# Altium project Big-MCU_REVB.PrjPcb
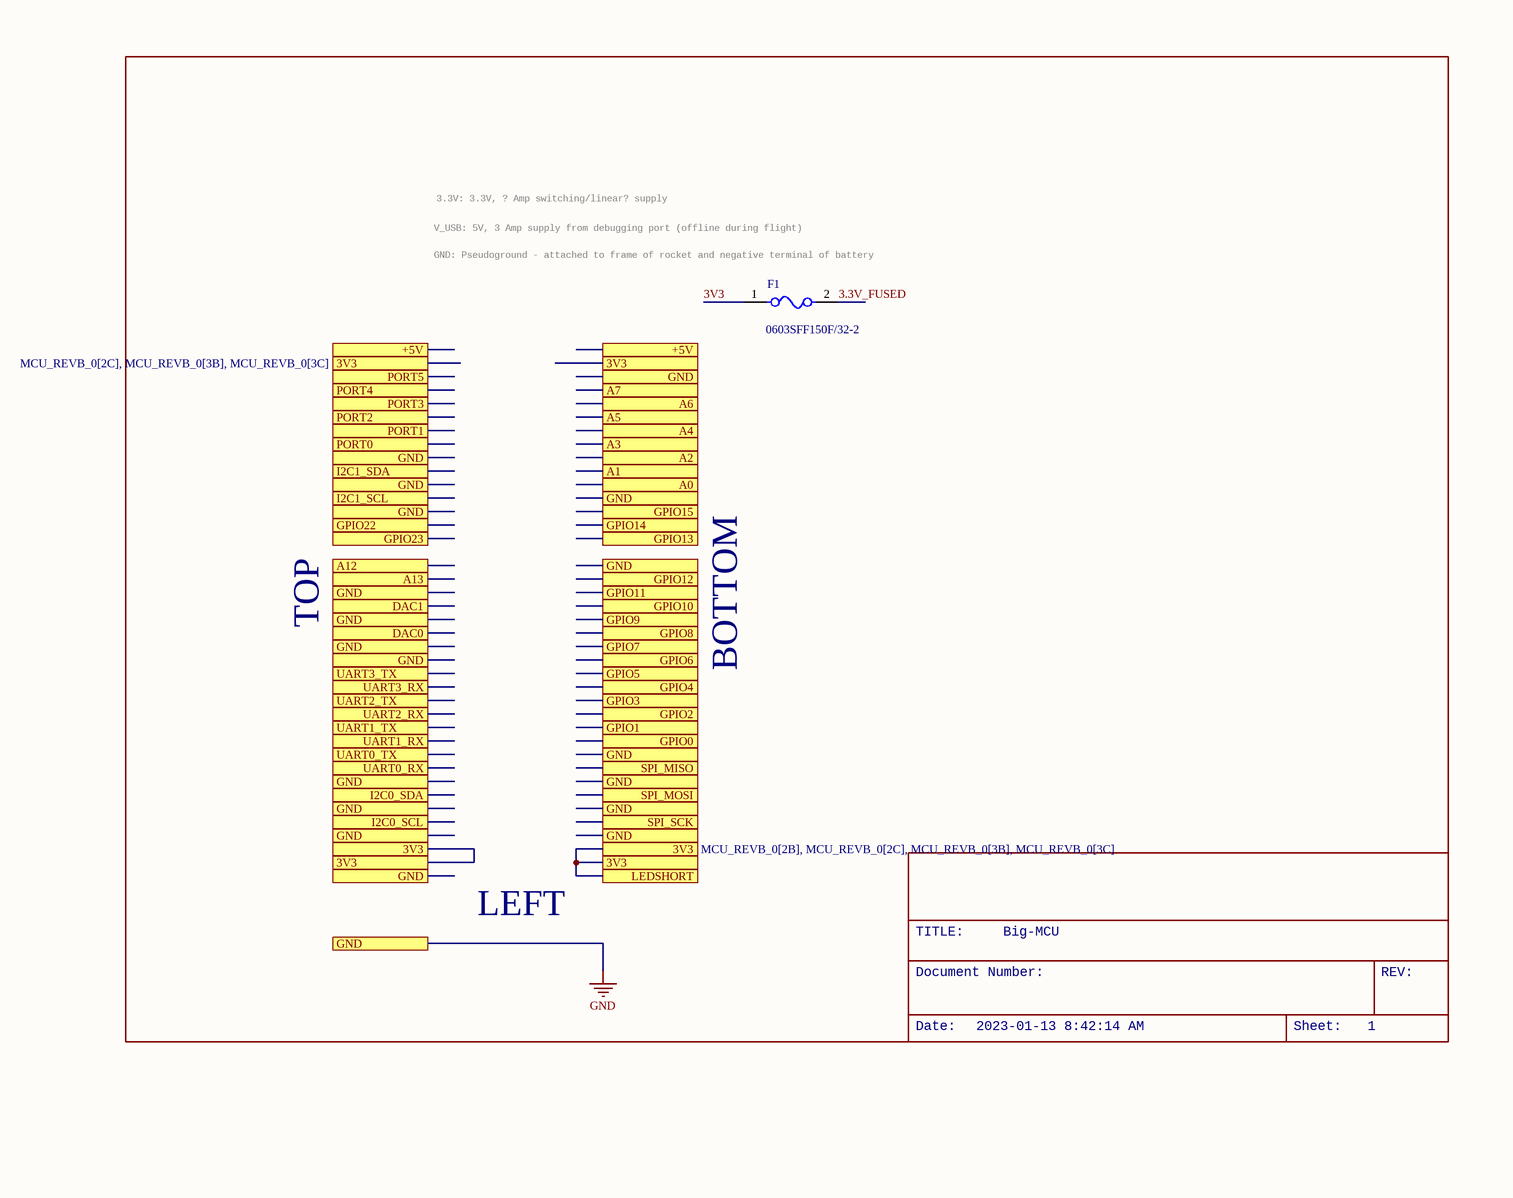
[diagram p0: MCU_REVB_0.SchDoc]
5 sheets, 113 parts. Net scope: global (net labels, ports and power ports of the same name join across sheets).
Board file: MCU_REVB.PcbDoc
Sheets:
  MCU_REVB_0.SchDoc
  MCU_REVB_1.SchDoc
  MCU_REVB_2.SchDoc
  MCU_REVB_3.SchDoc
  MCU_REVB_4.SchDoc

## Sheet MCU_REVB_0.SchDoc: Big-MCU
size 270 x 223 mm; Origin: Eagle; Date: 2023-01-13 8:42:14 AM; SheetNumber: 1; GateName_1: G$1; SymbolName_1: LETTER_L; LibraryName: frames; DeviceSetName: LETTER_L; GateName_2: G$2; SymbolName_2: DOCFIELD; Sheet: Sheet:; REV: REV:

### Parts
F1  0603SFF150F/32-2  [RESC1608X10N]

### Ports
3V3 (see MCU_REVB_0[2B], MCU_REVB_0[2C], MCU_REVB_0[3B], MCU_REVB_0[3C]), 3V3 (see MCU_REVB_0[2B], MCU_REVB_0[2C], MCU_REVB_0[3C]), 3V3 (see MCU_REVB_0[2C], MCU_REVB_0[3B], MCU_REVB_0[3C]), +5V (see MCU_REVB_0[2B]), +5V (see MCU_REVB_0[3B]), A0, A1, A2, A3, A4, A5, A6, A7, A12, A13, DAC0, DAC1, GND (see MCU_REVB_0[2B], MCU_REVB_0[2C], MCU_REVB_0[2D], MCU_REVB_0[3B], MCU_REVB_0[3C]), GND (see MCU_REVB_0[2B], MCU_REVB_0[2C], MCU_REVB_0[3B], MCU_REVB_0[3C]), GPIO0, GPIO1, GPIO2, GPIO3, GPIO4, GPIO5, GPIO6, GPIO7, GPIO8, GPIO9, GPIO10, GPIO11, GPIO12, GPIO13, GPIO14, GPIO15, GPIO22, GPIO23, I2C0_SCL, I2C0_SDA, I2C1_SCL, I2C1_SDA, LEDSHORT, PORT0, PORT1, PORT2, PORT3, PORT4, PORT5, SPI_MISO, SPI_MOSI, SPI_SCK, UART0_RX, UART0_TX, UART1_RX, UART1_TX, UART2_RX, UART2_TX, UART3_RX, UART3_TX

### Nets
3.3V_FUSED: F1.2
3V3: F1.1
3V3: port 3V3, port LEDSHORT  [a separate net that carries the same name]

### Notes on the sheet
- 3.3V: 3.3V, ? Amp switching/linear? supply
- V_USB: 5V, 3 Amp supply from debugging port (offline during flight)
- (near F1) GND: Pseudoground - attached to frame of rocket and negative terminal of battery
- TOP
- BOTTOM
- LEFT
- TITLE:
- Big-MCU
- Document Number:
- REV:
- Date:
- 2023-01-13 8:42:14 AM
- Sheet:
- 1

### Library data of the parts
F1 = CMP-00019-1: 0603SFF Series - 0603 Size Lead-Free, Halogen Free, Fast-Acting Chip Fuse, 1.5 A, 63 VDC, RoHS; Approvals: UL; Fuse Type: Board Mount (Cartridge Style Excluded); DC Cold Resistance: 175mR; Current Rating: 500mA; Value: 175mR; Voltage Rating: 50V; Case/Package: 0603; Pins: 2; Mounting Technology: Surface Mount; Case Code (Metric): 1608; Fuse Current: 500mA; Reach SVHC Compliant: Yes; Series: SF-0603S; Width: 0.8mm; Max Operating Temperature: 105°C; Packaging: Tape and Reel; Depth: 0.8mm; Min Operating Temperature: -20°C; RoHS Compliant: Yes; Package Quantity: 10000; Height: 0.45mm; Length: 1.6mm; Current: 500mA; Case Code (Imperial): 0603; Contact Plating: Tin; Voltage Rating (DC): 50V; Termination: SMD/SMT

## Sheet MCU_REVB_1.SchDoc: Big-MCU
size 270 x 228 mm; Origin: Eagle; Date: 2023-01-13 8:42:14 AM; SheetNumber: 2; GateName_1: G$1; SymbolName_1: LETTER_L; LibraryName: frames; DeviceSetName: LETTER_L; GateName_2: G$2; SymbolName_2: DOCFIELD; Sheet: Sheet:; REV: REV:
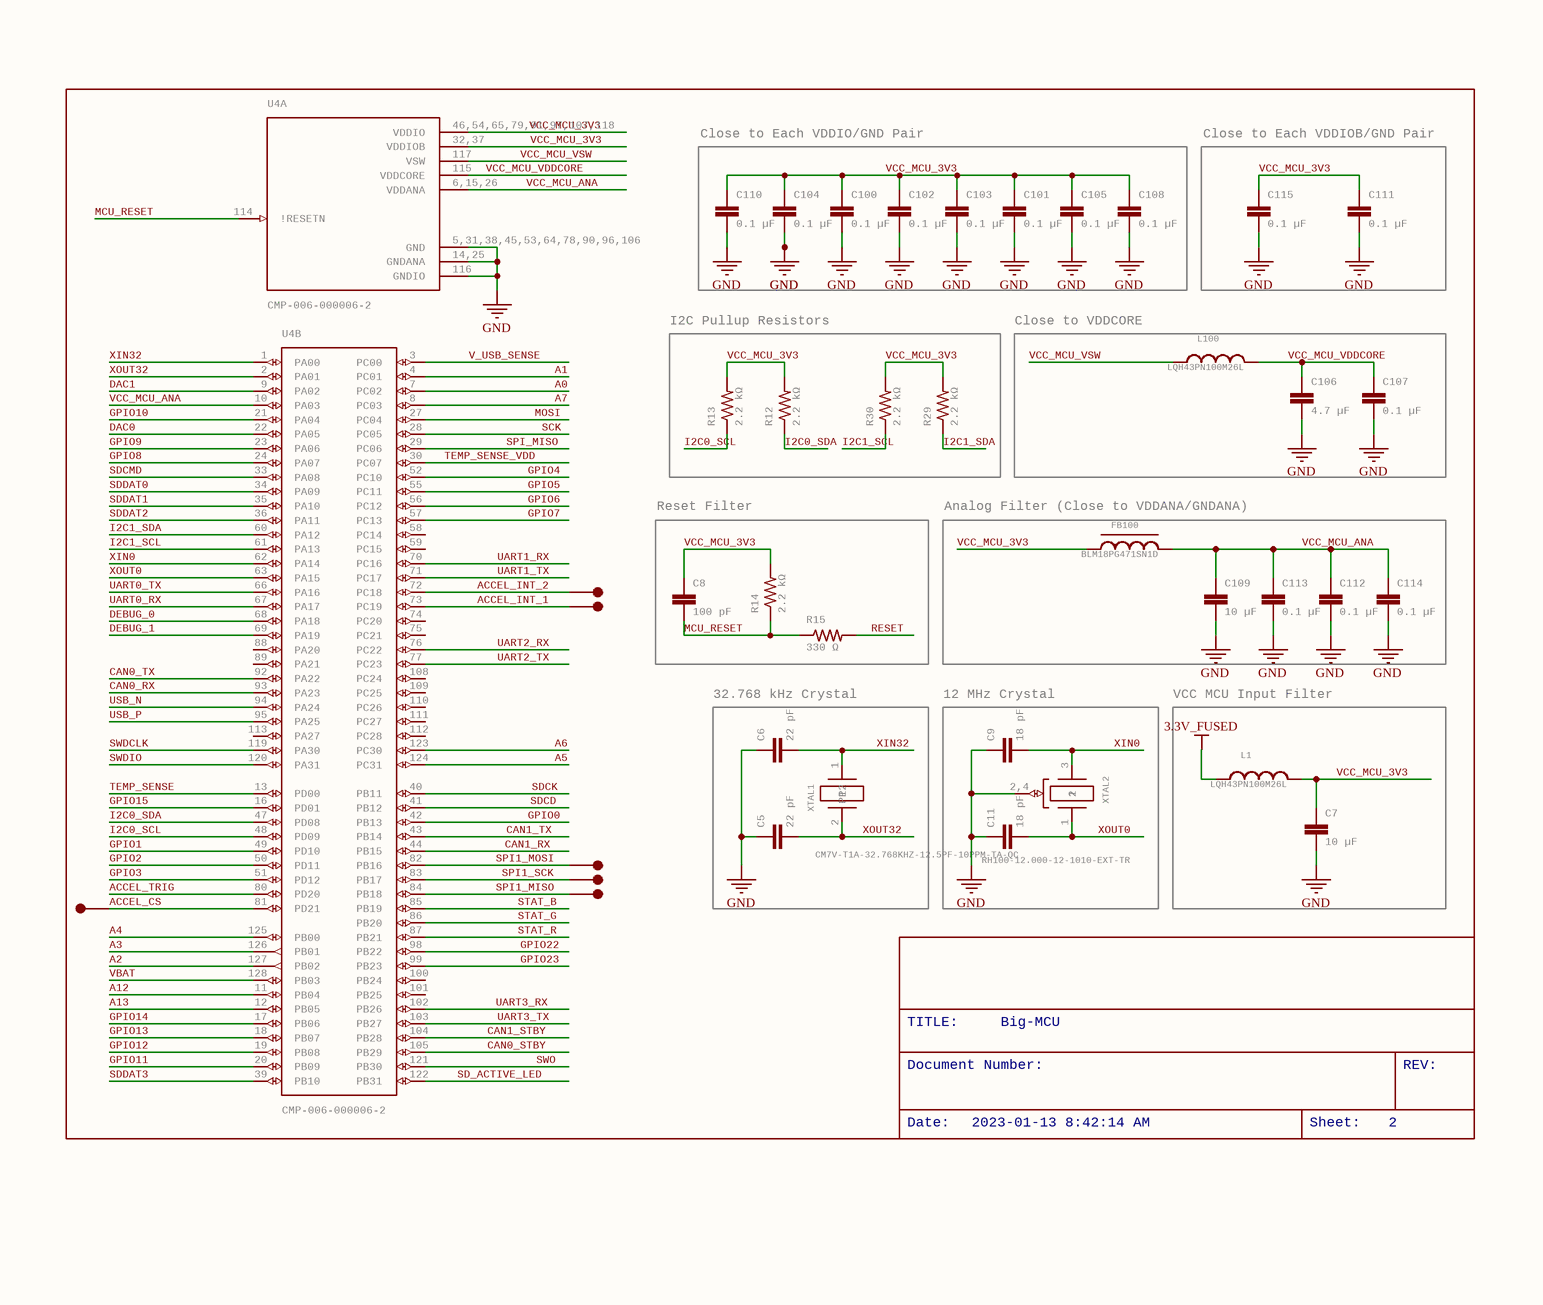
[diagram p1: MCU_REVB_1.SchDoc]

### Parts
C5  22 pF  [C0805]
C6  22 pF  [C0805]
C7  10 µF  [C1206]
C8  100 pF  [C0805]
C9  18 pF  [C0805]
C11  18 pF  [C0805]
C100  0.1 µF  [C0805]
C101  0.1 µF  [C0805]
C102  0.1 µF  [C0805]
C103  0.1 µF  [C0805]
C104  0.1 µF  [C0805]
C105  0.1 µF  [C0805]
C106  4.7 µF  [C0805]
C107  0.1 µF  [C0805]
C108  0.1 µF  [C0805]
C109  10 µF  [C1206]
C110  0.1 µF  [C0805]
C111  0.1 µF  [C0805]
C112  0.1 µF  [C0805]
C113  0.1 µF  [C0805]
C114  0.1 µF  [C0805]
C115  0.1 µF  [C0805]
FB100  BLM18PG471SN1D  [FP-BLM18-0_15-t0_8-MFG]
L1  LQH43PN100M26L  [LQH43PN100M26L]
L100  LQH43PN100M26L  [LQH43PN100M26L]
R12  2.2 kΩ  [6-0805_N]
R13  2.2 kΩ  [6-0805_N]
R14  2.2 kΩ  [6-0805_N]
R15  330 Ω  [6-0805_N]
R29  2.2 kΩ  [6-0805_N]
R30  2.2 kΩ  [6-0805_N]
TP11  5015  [KEYSTONE_5015]  (value not drawn)
TP12  5015  [KEYSTONE_5015]  (value not drawn)
TP13  5015  [KEYSTONE_5015]  (value not drawn)
TP14  5015  [KEYSTONE_5015]  (value not drawn)
TP15  5015  [KEYSTONE_5015]  (value not drawn)
TP16  5015  [KEYSTONE_5015]  (value not drawn)
U4  CMP-006-000006-2  [FP-MG-IPC_A]  (parts A,B of 2)
XTAL1  CM7V-T1A-32.768KHZ-12.5PF-10PPM-TA-QC  [DFN245P320X65-2N]
XTAL2  RH100-12.000-12-1010-EXT-TR  [SON160P320X80-4N]

### Blocks framed on the sheet
Close to Each VDDIO/GND Pair: C100-C105 C108 C110
Close to Each VDDIOB/GND Pair: C111 C115
I2C Pullup Resistors: R12 R13 R29 R30
Close to VDDCORE: C106 C107 L100
Reset Filter: C8 R14 R15
Analog Filter (Close to VDDANA/GNDANA): C109 C112-C114 FB100
32.768 kHz Crystal: C5 C6 XTAL1
12 MHz Crystal: C9 C11 XTAL2
VCC MCU Input Filter: C7 L1

### Nets
3.3V_FUSED: L1.1
GND: C5.1 C6.1 C7.2 C9.1 C11.1 C100.2 C101.2 C102.2 C103.2 C104.2 C105.2 C106.2 C107.2 C108.2 C109.2 C110.2 C111.2 C112.2 C113.2 C114.2 C115.2 U4.5,31,38,45,53,64,78,90,96,106(GND) U4.14,25(GNDANA) U4.116(GNDIO) XTAL2.2,4
A0: U4.7(PC02)
A1: U4.4(PC01)
A2: U4.127(PB02)
A3: U4.126(PB01)
A4: U4.125(PB00)
A5: U4.124(PC31)
A6: U4.123(PC30)
A7: U4.8(PC03)
A12: U4.11(PB04)
A13: U4.12(PB05)
ACCEL_CS: TP15.1(TP) U4.81(PD21)
ACCEL_INT_1: TP11.1(TP) U4.73(PC19)
ACCEL_INT_2: TP13.1(TP) U4.72(PC18)
ACCEL_TRIG: U4.80(PD20)
CAN0_RX: U4.93(PA23)
CAN0_STBY: U4.105(PB29)
CAN0_TX: U4.92(PA22)
CAN1_RX: U4.44(PB15)
CAN1_STBY: U4.104(PB28)
CAN1_TX: U4.43(PB14)
DAC0: U4.22(PA05)
DAC1: U4.9(PA02)
DEBUG_0: U4.68(PA18)
DEBUG_1: U4.69(PA19)
GPIO0: U4.42(PB13)
GPIO1: U4.49(PD10)
GPIO2: U4.50(PD11)
GPIO3: U4.51(PD12)
GPIO4: U4.52(PC10)
GPIO5: U4.55(PC11)
GPIO6: U4.56(PC12)
GPIO7: U4.57(PC13)
GPIO8: U4.24(PA07)
GPIO9: U4.23(PA06)
GPIO10: U4.21(PA04)
GPIO11: U4.20(PB09)
GPIO12: U4.19(PB08)
GPIO13: U4.18(PB07)
GPIO14: U4.17(PB06)
GPIO15: U4.16(PD01)
GPIO22: U4.98(PB22)
GPIO23: U4.99(PB23)
I2C0_SCL: R13.1 U4.48(PD09)
I2C0_SDA: R12.1 U4.47(PD08)
I2C1_SCL: R30.1 U4.61(PA13)
I2C1_SDA: R29.1 U4.60(PA12)
MCU_RESET: C8.2 R14.1 R15.1 U4.114(!RESETN)
MOSI: U4.27(PC04)
RESET: R15.2
SCK: U4.28(PC05)
SD_ACTIVE_LED: U4.122(PB31)
SDCD: U4.41(PB12)
SDCK: U4.40(PB11)
SDCMD: U4.33(PA08)
SDDAT0: U4.34(PA09)
SDDAT1: U4.35(PA10)
SDDAT2: U4.36(PA11)
SDDAT3: U4.39(PB10)
SPI1_MISO: TP16.1(TP) U4.84(PB18)
SPI1_MOSI: TP12.1(TP) U4.82(PB16)
SPI1_SCK: TP14.1(TP) U4.83(PB17)
SPI_MISO: U4.29(PC06)
STAT_B: U4.85(PB19)
STAT_G: U4.86(PB20)
STAT_R: U4.87(PB21)
SWDCLK: U4.119(PA30)
SWDIO: U4.120(PA31)
SWO: U4.121(PB30)
TEMP_SENSE: U4.13(PD00)
TEMP_SENSE_VDD: U4.30(PC07)
UART0_RX: U4.67(PA17)
UART0_TX: U4.66(PA16)
UART1_RX: U4.70(PC16)
UART1_TX: U4.71(PC17)
UART2_RX: U4.76(PC22)
UART2_TX: U4.77(PC23)
UART3_RX: U4.102(PB26)
UART3_TX: U4.103(PB27)
USB_N: U4.94(PA24)
USB_P: U4.95(PA25)
V_USB_SENSE: U4.3(PC00)
VBAT: U4.128(PB03)
VCC_MCU_3V3: C7.1 C8.1 C100.1 C101.1 C102.1 C103.1 C104.1 C105.1 C108.1 C110.1 C111.1 C115.1 FB100.1 L1.2 R12.2 R13.2 R14.2 R29.2 R30.2 U4.32,37(VDDIOB) U4.46,54,65,79,91,97,107,118(VDDIO)
VCC_MCU_ANA: C109.1 C112.1 C113.1 C114.1 FB100.2 U4.6,15,26(VDDANA) U4.10(PA03)
VCC_MCU_VDDCORE: C106.1 C107.1 L100.2 U4.115(VDDCORE)
VCC_MCU_VSW: L100.1 U4.117(VSW)
XIN0: C9.2 U4.62(PA14) XTAL2.3(2)
XIN32: C6.2 U4.1(PA00) XTAL1.1(P1)
XOUT0: C11.2 U4.63(PA15) XTAL2.1
XOUT32: C5.2 U4.2(PA01) XTAL1.2(P2)

Not connected (* = marked no-connect by the designer): U4 58(PC14) 59(PC15) 74(PC20) 75(PC21) 88(PA20) 89(PA21) 100(PB24) 101(PB25) 108(PC24) 109(PC25) 110(PC26) 111(PC27) 112(PC28) 113(PA27)

### Notes on the sheet
- TITLE:
- Big-MCU
- Document Number:
- REV:
- Date:
- 2023-01-13 8:42:14 AM
- Sheet:
- 2

### Library data of the parts
C5 C6 C8 C9 C11 C100-C108 C110-C115 = C-EUC0805: CAPACITOR, European symbol; GateName_1: G$1; SymbolName_1: C-EU; POPULARITY: 88; DeviceName: C0805; LibraryName: rcl; DeviceSetName: C-EU; SPICEPREFIX: C
C7 C109 = C-EUC1206: CAPACITOR, European symbol; GateName_1: G$1; SymbolName_1: C-EU; POPULARITY: 54; DeviceName: C1206; LibraryName: rcl; DeviceSetName: C-EU; SPICEPREFIX: C
FB100 = CMP-006-000008-2: 0603 470Ω ±25% DCR=0.20Ω 1A; GateName_1: G$1; SymbolName_1: FERRITE_BEAD; Value: 200mR; Material: Steel,Ferrite; Impedance: 470R; Number of Circuits: 1; Core Material: Ferrite; Test Frequency: 100MHz; LibraryName: MCU Board; DeviceSetName: BLM18PG471SN1D; Component Type: Standard; Design Item ID: BLM18PG471SN1D; Package: 0603; Pin Count: 2; Source: MCU Board.SCHLIB; Lead Free: Lead Free; Length: 1.6mm; Radiation Hardening: No; DC Current: 1A; Current Rating: 1A; Military Standard: Not; Package Quantity: 1; RoHS Compliant: Yes; Max Operating Temperature: 125°C; DC Resistance (DCR): 200mR; Max Current Rating: 1A; Packaging: Tape and Reel; Termination: SMD/SMT; Case Code (Metric): 1608; Width: 0.8mm; Pins: 2; Height: 0.8mm; Min Operating Temperature: -55°C; Depth: 0.8mm; Series: BLM18P; Number of Lines: 1; DC Resistance-Max: 200mR; Case/Package: 0603; Reach SVHC Compliant: Yes; Tolerance: 25%; Case Code (Imperial): 0603; Max DC Current: 1A
L1 L100 = CMP-004-000001-3: GateName_1: G$1; SymbolName_1: INDUCTOR; LibraryName: MCU Board; DeviceSetName: LQH43PN100M26L; Component Type: Standard; Design Item ID: LQH43PN100M26L; Package: LQH43PN100M26L; Pin Count: 2; Source: MCU Board.SCHLIB
R12-R15 R29 R30 = R-US_R0805: RESISTOR, American symbol; GateName_1: G$1; SymbolName_1: R-US; DeviceName: R0805; DeviceSetName: R-US_; POPULARITY: 85; LibraryName: rcl; SPICEPREFIX: R
TP11-TP16 = CMP-005-000003-3: GateName_1: G$1; MF: Keystone Electronics; SymbolName_1: 5015; LibraryName: MCU Board; DeviceSetName: 5015; AVAILABILITY: Unavailable; MOUSER-PURCHASE-URL: https://snapeda.com/shop?store=Mouser&id=48459; MP: 5015; Package: KEYSTONE_5015; PRICE: None; Component Type: Standard; Design Item ID: 5015; Pin Count: 1; Source: MCU Board.SCHLIB
U4 = CMP-006-000006-2: 120MHZ 1024KB Flash 128 TQFP PKG inTapeNReel 85CTemp 128 TQFP 14x14x1mm T/R RoHS Compliant: Yes; GateName_1: G$1; SymbolName_1: ATSAMD51P20A-AU_SECTION1; GateName_2: G$2; SymbolName_2: ATSAMD51P20A-AU_SECTION2; DeviceSetName: ATSAMD51P20A-AU; MF: Microchip; Interface: I2C,SPI,USB,IrDA,MMC,SD,UART,USART,EBI/EMI; Core Architecture: ARM; Oscillator Type: Internal; Peripherals: Brown-out Detect/Reset,POR,PWM,DMA; Memory Size: 1MB; Number of I/Os: 99; LibraryName: MCU Board; AVAILABILITY: Unavailable; MP: ATSAMD51P20A-AU; Package: QFP40P1600X1600X120-128N; PRICE: None; Source: MCU Board.SCHLIB; Pin Count: 108; Frequency: 120MHz; Case/Package: TQFP; Design Item ID: ATSAMD51P20A-AU; Component Type: Standard; Max Operating Temperature: 85°C; Memory Format: FLASH; Pins: 128; Min Operating Temperature: -40°C; Packaging: Cut Tape
XTAL1 = CMP-006-000011-2: Crystal 32.768KHZ 12.5PF SMD; GateName_1: G$1; SymbolName_1: OSCILLATOR; Frequency Tolerance: 10ppm; ESR: 70kR; LibraryName: MCU Board; DeviceSetName: CM7V-T1A-32.768KHZ-12.5PF-10PPM-TA-QC; Component Type: Standard; Design Item ID: CM7V-T1A-32.768KHZ-12.5PF-10PPM-TA-QC; Package: CM7V-T1A-32.768KHZ-12.5PF-10PPM-TA-QC; Pin Count: 2; Source: MCU Board.SCHLIB; Width: 1.5mm; Mounting Technology: Surface Mount; Height: 0.65mm; Max Operating Temperature: 85°C; Frequency: 32.768kHz; Case/Package: SMD/SMT; Length: 3.2mm; Pins: 2; Min Operating Temperature: -40°C; Load Capacitance: 12.5pF
XTAL2 = CMP-006-000019-2: pin to pad: 2,4>2+4; GateName_1: G$1; SymbolName_1: CRYSTAL_W_GROUND; LibraryName: MCU Board; DeviceSetName: RH100-12.000-12-1010-EXT-TR; Component Type: Standard; Design Item ID: RH100-12.000-12-1010-EXT-TR; Package: RH100-12.000-12-1010-EXT-TR; Pin Count: 3; Source: MCU Board.SCHLIB

## Sheet MCU_REVB_2.SchDoc: Big-MCU
size 270 x 223 mm; Origin: Eagle; Date: 2023-01-13 8:42:14 AM; SheetNumber: 3; GateName_1: G$1; SymbolName_1: LETTER_L; LibraryName: frames; DeviceSetName: LETTER_L; GateName_2: G$2; SymbolName_2: DOCFIELD; Sheet: Sheet:; REV: REV:
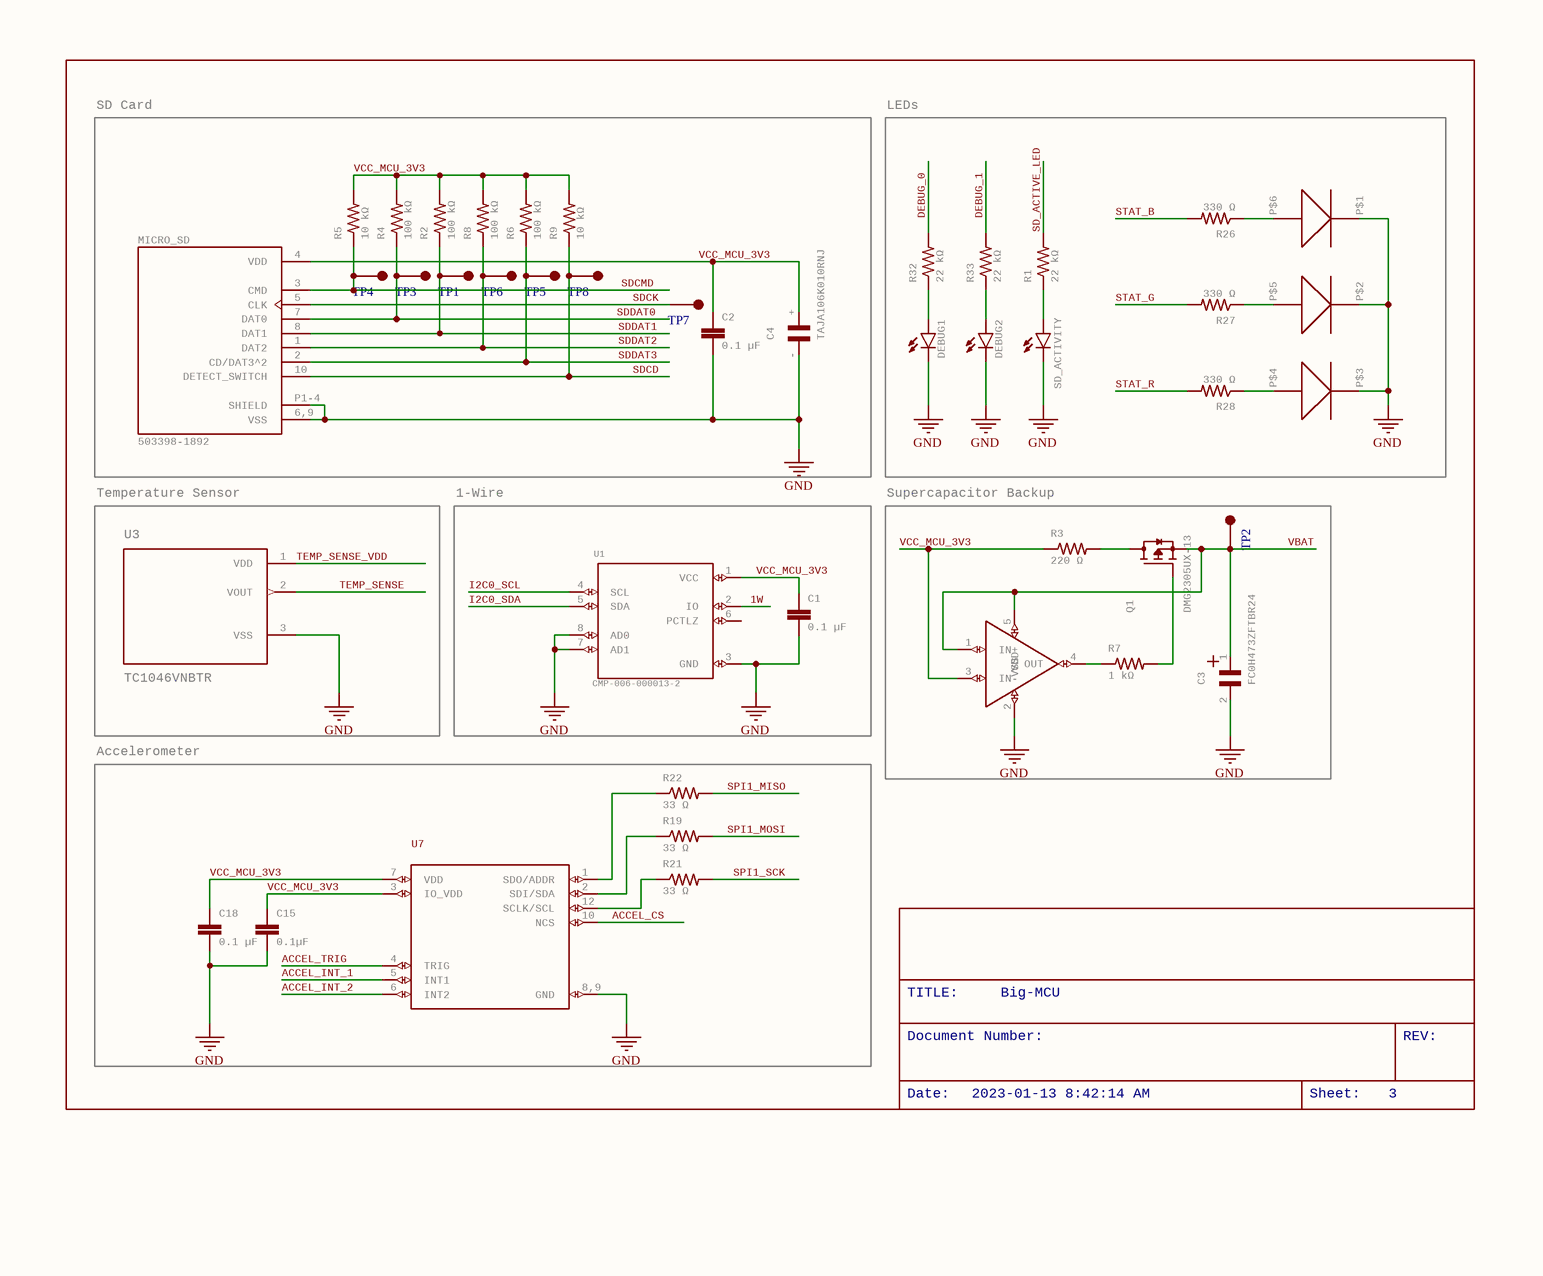
[diagram p2: MCU_REVB_2.SchDoc]

### Parts
C1  0.1 µF  [C0805]
C2  0.1 µF  [C0805]
C3  FC0H473ZFTBR24  [CAPAE1080X580N]
C4  TAJA106K010RNJ  [FP-TAJA-MFG]
C15  0.1µF  [C0805]
C18  0.1 µF  [C0805]
DEBUG1  LEDSML0805  [6-0805_N]  (value not drawn)
DEBUG2  LEDSML0805  [6-0805_N]  (value not drawn)
MICRO_SD  503398-1892  [MOLX-503398-1892_V]
Q1  DMG2305UX-13  [FP-SOT23-MFG]
R1  22 kΩ  [6-0805_N]
R2  100 kΩ  [6-0805_N]
R3  220 Ω  [6-0805_N]
R4  100 kΩ  [6-0805_N]
R5  10 kΩ  [6-0805_N]
R6  100 kΩ  [6-0805_N]
R7  1 kΩ  [6-0805_N]
R8  100 kΩ  [6-0805_N]
R9  10 kΩ  [6-0805_N]
R19  33 Ω  [6-0805_N]
R21  33 Ω  [6-0805_N]
R22  33 Ω  [6-0805_N]
R26  330 Ω  [6-0805_N]
R27  330 Ω  [6-0805_N]
R28  330 Ω  [6-0805_N]
R32  22 kΩ  [6-0805_N]
R33  22 kΩ  [6-0805_N]
SD_ACTIVITY  LEDSML0805  [6-0805_N]  (value not drawn)
STATUS  MSL0402RGB  [FP-MSL0402-MFG]  (value not drawn)
TP1  5015  [KEYSTONE_5015]  (value not drawn)
TP2  5015  [KEYSTONE_5015]  (value not drawn)
TP3  5015  [KEYSTONE_5015]  (value not drawn)
TP4  5015  [KEYSTONE_5015]  (value not drawn)
TP5  5015  [KEYSTONE_5015]  (value not drawn)
TP6  5015  [KEYSTONE_5015]  (value not drawn)
TP7  5015  [KEYSTONE_5015]  (value not drawn)
TP8  5015  [KEYSTONE_5015]  (value not drawn)
U1  CMP-006-000013-2  [SOIC127P600X175-8N]
U2  BU7265SG-TR  [SOT95P280X125-5N]  (value not drawn)
U3  TC1046VNBTR  [SOT-23-NB3_N]
U7  KX134-1211  [FP-KX134-1211-MFG]  (value not drawn)

### Blocks framed on the sheet
SD Card: C2 C4 MICRO_SD R2 R4-R6 R8 R9 TP1 TP3-TP8
LEDs: DEBUG1 DEBUG2 R1 R26-R28 R32 R33 SD_ACTIVITY STATUS
Temperature Sensor: U3
1-Wire: C1 U1
Supercapacitor Backup: C3 Q1 R3 R7 TP2 U2
Accelerometer: C15 C18 R19 R21 R22 U7

### Nets
GND: C1.2 C2.2 C3.2 C4.- C15.2 C18.2 DEBUG1.2(C) DEBUG2.2(C) MICRO_SD.6,9(VSS) MICRO_SD.P1-4(SHIELD) SD_ACTIVITY.2(C) STATUS.P1(P$1) STATUS.P2(P$2) STATUS.P3(P$3) U1.3(GND) U1.7(AD1) U1.8(AD0) U2.2(VSS) U3.3(VSS) U7.8,9(GND)
1W: U1.2(IO)
ACCEL_CS: U7.10(NCS)
ACCEL_INT_1: U7.5(INT1)
ACCEL_INT_2: U7.6(INT2)
ACCEL_TRIG: U7.4(TRIG)
DEBUG_0: R32.2
DEBUG_1: R33.2
I2C0_SCL: U1.4(SCL)
I2C0_SDA: U1.5(SDA)
SD_ACTIVE_LED: R1.2
SDCD: MICRO_SD.10(DETECT_SWITCH) R9.1 TP8.1(TP)
SDCK: MICRO_SD.5(CLK) TP7.1(TP)
SDCMD: MICRO_SD.3(CMD) R5.1 TP4.1(TP)
SDDAT0: MICRO_SD.7(DAT0) R4.1 TP3.1(TP)
SDDAT1: MICRO_SD.8(DAT1) R2.1 TP1.1(TP)
SDDAT2: MICRO_SD.1(DAT2) R8.1 TP6.1(TP)
SDDAT3: MICRO_SD.2(CD/DAT3^2) R6.1 TP5.1(TP)
SPI1_MISO: R22.2
SPI1_MOSI: R19.2
SPI1_SCK: R21.2
STAT_B: R26.2
STAT_G: R27.2
STAT_R: R28.2
TEMP_SENSE: U3.2(VOUT)
TEMP_SENSE_VDD: U3.1(VDD)
VBAT: C3.1 Q1.2(S) TP2.1(TP) U2.1(IN+) U2.5(VDD)
VCC_MCU_3V3: C1.1 C2.1 C4.+ C15.1 C18.1 MICRO_SD.4(VDD) R2.2 R3.1 R4.2 R5.2 R6.2 R8.2 R9.2 U1.1(VCC) U2.3(IN-) U7.3(IO_VDD) U7.7(VDD)
NetDEBUG1_1: DEBUG1.1(A) R32.1
NetDEBUG2_1: DEBUG2.1(A) R33.1
NetQ1_1: Q1.1(G) R7.2
NetQ1_3: Q1.3(D) R3.2
NetR1_1: R1.1 SD_ACTIVITY.1(A)
NetR7_1: R7.1 U2.4(OUT)
NetR19_1: R19.1 U7.2(SDI/SDA)
NetR21_1: R21.1 U7.12(SCLK/SCL)
NetR22_1: R22.1 U7.1(SDO/ADDR)
NetR26_1: R26.1 STATUS.P6(P$6)
NetR27_1: R27.1 STATUS.P5(P$5)
NetR28_1: R28.1 STATUS.P4(P$4)

Not connected (* = marked no-connect by the designer): U1 6(PCTLZ)

### Notes on the sheet
- TITLE:
- Big-MCU
- Document Number:
- REV:
- Date:
- 2023-01-13 8:42:14 AM
- Sheet:
- 3

### Library data of the parts
C1 C2 C15 C18 = C-EUC0805: as C5 on sheet MCU_REVB_1; DeviceName: C0805; LibraryName: rcl; DeviceSetName: C-EU; SPICEPREFIX: C
C3 = CMP-002-000008-3: GateName_1: G$1; SymbolName_1: CAP_POL; LibraryName: MCU Board; DeviceSetName: FC0H473ZFTBR24; Component Type: Standard; Design Item ID: FC0H473ZFTBR24; Package: CAPAE1080X580N; Pin Count: 2; Source: MCU Board.SCHLIB
C4 = CMP-002-000009-2: Cap Tant Solid 10uF 10V A CASE 10%( 3.2 X 1.6 X 1.6mm) Inward L SMD 3216-18 3 Ohm 125C T/R; pin to pad: +>2 ->1; GateName_1: G$1; SymbolName_1: CAP; LibraryName: MCU Board; DeviceSetName: TAJA106K010RNJ; Component Type: Standard; Design Item ID: TAJA106K010RNJ; Package: 1206-POL; Pin Count: 2; Source: MCU Board.SCHLIB
DEBUG1 DEBUG2 SD_ACTIVITY = LEDSML0805: LED   OSRAM: - CHIPLED LG R971, LG N971, LY N971, LG Q971, LY Q971, LO R971, LY R971 LH N974, LH R974 LS Q976, LO Q976, LY Q976 LO Q996 - Hyper CHIPLED LW Q18S LB Q993, LB Q99A, LB R99A - SideLED LS A670, LO A670, LY A670, LG A670, LP A670 LB A673, LV A673, LT A673, LW A673 LH A674 LY A675 LS A676, LA A676, LO A676, LY A676, LW A676 LS A679, LY A679, LG A679 -  Hyper Micro SIDELEDÂ® LS Y876, LA Y876, LO Y876, LY Y876 LT Y87S - SmartLED LW L88C, LW L88S LB L89C, LB L89S, LG L890 LS L89K, LO L89K, LY L89K LS L896, LA L896, LO L896, LY L896 - TOPLED LS T670, LO T670, LY T670, LG T670, LP T670 LSG T670, LSP T670, LSY T670, LOP T670, LYG T670 LG T671, LOG T671, LSG T671 LB T673, LV T673, LT T673, LW T673 LH T674 LS T676, LA T676, LO T676, LY T676, LB T676, LH T676, LSB T676, LW T676 LB T67C, LV T67C, LT T67C, LS T67K, LO T67K, LY T67K, LW E67C LS E67B, LA E67B, LO E67B, LY E67B, LB E67C, LV E67C, LT E67C LW T67C LS T679, LY T679, LG T679 LS T770, LO T770, LY T770, LG T770, LP T770 LB T773, LV T773, LT T773, LW T773 LH T774 LS E675, LA E675, LY E675, LS T675 LS T776, LA T776, LO T776, LY T776, LB T776 LHGB T686 LT T68C, LB T68C - Hyper Mini TOPLEDÂ® LB M676 - Mini TOPLED SantanaÂ® LG M470 LS M47K, LO M47K, LY M47K    Source: http://www.osram.convergy.de   LUXEON: - LUMILEDÂ® LXK2-PW12-R00, LXK2-PW12-S00, LXK2-PW14-U00, LXK2-PW14-V00 LXK2-PM12-R00, LXK2-PM12-S00, LXK2-PM14-U00 LXK2-PE12-Q00, LXK2-PE12-R00, LXK2-PE12-S00, LXK2-PE14-T00, LXK2-PE14-U00 LXK2-PB12-K00, LXK2-PB12-L00, LXK2-PB12-M00, LXK2-PB14-N00, LXK2-PB14-P00, LXK2-PB14-Q00 LXK2-PR12-L00, LXK2-PR12-M00, LXK2-PR14-Q00, LXK2-PR14-R00 LXK2-PD12-Q00, LXK2-PD12-R00, LXK2-PD12-S00 LXK2-PH12-R00, LXK2-PH12-S00 LXK2-PL12-P00, LXK2-PL12-Q00, LXK2-PL12-R00    Source: www.luxeon.com   KINGBRIGHT:   KA-3528ASYC Source: www.kingbright.com; GateName_1: G$1; POPULARITY: 17; SymbolName_1: LED; DeviceName: SML0805; LibraryName: led; DeviceSetName: LED
MICRO_SD = CMP-006-000002-3: 1.10mm Pitch microSD Memory Card Connector, Normal Mount Surface Mount, Push-Push Type, 1.28mm Height; pin to pad: 6,9>6+9 P1-4>11+12+13+14; GateName_1: G$1; Current Rating: 500mA; Gender: Male; Number of Contacts: 8; Pitch: 1.1mm; Voltage Rating (AC): 10V; SymbolName_1: 503398-1892; LibraryName: MCU Board; DeviceSetName: 503398-1892; Component Type: Standard; Design Item ID: 503398-1892; Package: MOLEX_503398-1892; Pin Count: 10; Source: MCU Board.SCHLIB; Number of Rows: 1; RoHS Compliant: Yes; Housing Material: Thermoplastic; Connector Type: Connector; Radiation Hardening: No; Series: 503398; Halogen Free: Low Halogen; Contact Plating: Gold; Max Operating Temperature: 85°C; Depth: 14.05mm; Min Operating Temperature: -25°C; Length: 13.6mm; Packaging: Tape and Reel; Package Quantity: 2400; Contact Material: Bronze,Stainless Steel; Mounting Technology: Surface Mount; Width: 14.05mm; Number of Circuits: 8; Termination: Solder; Orientation: Right Angle
Q1 = CMP-006-000012-2: P-Channel 20 V 65 Ohms Surface Mount Enhancement Mode Mosfet - SOT-23-3; GateName_1: G$1; MF: Diodes Zetex; Drain-source On Resistance-Max: 65MR; Threshold Voltage: -900mV; Drain to Source Resistance: 52mR; Max Power Dissipation: 1.4W; Rise Time: 13.7ns; Continuous Drain Current (ID): 4.2A; Number of Channels: 1; Drain to Source Voltage (Vdss): 20V; Input Capacitance: 808pF; Fall Time: 34.7ns; Element Configuration: Single; Turn-On Delay Time: 10.8ns; Gate to Source Voltage (Vgs): 8V; Turn-Off Delay Time: 79.3ns; Drain to Source Breakdown Voltage: -20V; SymbolName_1: DMG2305UX-13; LibraryName: MCU Board; DeviceSetName: DMG2305UX-13; AVAILABILITY: Good; MP: DMG2305UX-13; Package: SOT91P240X110-3N; PRICE: None; PURCHASE-URL: https://pricing.snapeda.com/search/part/DMG2305UX-13/?ref=eda; Design Item ID: DMG2305UX-13; Source: MCU Board.SCHLIB; Pin Count: 3; Component Type: Standard; Series: -; RoHS Compliant: Yes; Mounting Technology: Surface Mount; Radiation Hardening: No; Width: 1.4mm; Height: 1.1mm; Reach SVHC Compliant: Yes; Lead Free: Lead Free; On-State Resistance: 65MR; Max Operating Temperature: 150°C; Rds On Max: 52mR; Packaging: Tape and Reel; Pins: 3; Min Operating Temperature: -55°C; Weight: 0.000282oz; Package Quantity: 1; Case/Package: SOT-23; Polarity: P-CHANNEL; Length: 3mm
R1-R9 R19 R21 R22 R26-R28 R32 R33 = R-US_R0805: as R12 on sheet MCU_REVB_1; LibraryName: rcl; SPICEPREFIX: R
STATUS = CMP-003-000006-2: LEDRGBDIFFUSEDSMD; pin to pad: P1>1 P2>2 P3>3 P4>4 P5>5 P6>6; GateName_1: G$1; SymbolName_1: MSL0402RGB; LibraryName: MCU Board; DeviceSetName: MSL0402RGB; Component Type: Standard; Design Item ID: MSL0402RGB; Package: MSL0402RGB; Pin Count: 6; Source: MCU Board.SCHLIB
TP1-TP8 = CMP-005-000003-3: as TP11 on sheet MCU_REVB_1; SymbolName_1: 5015; LibraryName: MCU Board; DeviceSetName: 5015; AVAILABILITY: Unavailable; MOUSER-PURCHASE-URL: https://snapeda.com/shop?store=Mouser&id=48459; MP: 5015; Package: KEYSTONE_5015; PRICE: None; Component Type: Standard; Pin Count: 1; Source: MCU Board.SCHLIB; Design Item ID: 5015
U1 = CMP-006-000013-2: ds2482-100 single-channel 1-wire master i_c to 1-wire bridge device that interfaces directly to standard (100khz...; GateName_1: G$1; SymbolName_1: DS2482-100; LibraryName: MCU Board; DeviceSetName: DS2482-100; Component Type: Standard; Package: SOIC8; Design Item ID: DS2482-100; Pin Count: 8; Source: MCU Board.SCHLIB
U2 = CMP-006-000009-3: Operational Amplifier, Single, 4 kHz, 1, 2.4 V/ms, 1.8V to 5.5V, SSOP, 5 RoHS Compliant: Yes; GateName_1: G$1; SymbolName_1: OP-AMP; Slew Rate: 0.024V/µs; Gain Bandwidth Product: 4kHz; Amplifier Type: GENERAL PURPOSE; Number of Amplifiers: 1; Common Mode Rejection Ratio: 45dB; Input Offset Voltage (Vos): 1mV; Output Current per Channel: 4mA; Voltage Gain: 95dB; Operating Supply Current: 350nA; Input Bias Current: 1pA; LibraryName: MCU Board; DeviceSetName: BU7265SG-TR; Package: SOT95P285X145-5N; Pin Count: 5; Source: MCU Board.SCHLIB; Component Type: Standard; Design Item ID: BU7265SG-TR; Case/Package: SSOP; Bandwidth: 4kHz; Number of Circuits: 1; Series: -; Lead Free: Lead Free; Min Operating Temperature: -40°C; Radiation Hardening: No; RoHS Compliant: Yes; Max Operating Temperature: 105°C; Max Supply Voltage: 5.5V; Pins: 5; Package Quantity: 1; Min Supply Voltage: 1.8V; Mounting Technology: Surface Mount; Packaging: Tape and Reel
U3 = CMP-006-000023-2: Analog Output Temperature Sensor, 2.7 to 4.4V, SOT-23-3, RoHS; GateName_1: A; MF: Microchip; Min Supply Voltage: 2.7V; Output Type: Analog,Analog Voltage,Voltage; Max Output current: 100uA; Operating Supply Voltage: 3.3V; Operating Supply Current: 60uA; Accuracy: 2%; SymbolName_1: TC1046VNBTR; LibraryName: MCU Board; DeviceSetName: TC1046VNBTR; ARROW_ELECTRONICS-PURCHASE-URL: https://snapeda.com/shop?store=Arrow+Electronics&id=234729; AVAILABILITY: Good; DIGIKEY-PURCHASE-URL: https://snapeda.com/shop?store=DigiKey&id=234729; MOUSER-PURCHASE-URL: https://snapeda.com/shop?store=Mouser&id=234729; MP: TC1046VNBTR; Package: SOT95P237X112-3N; PRICE: None; Component Type: Standard; Design Item ID: TC1046VNBTR; Pin Count: 3; Source: MCU Board.SCHLIB; Height: 1.02mm; Mounting Technology: Surface Mount; RoHS Compliant: Yes; Radiation Hardening: No; Length: 3.05mm; Lead Free: Lead Free; Max Operating Temperature: 125°C; Contact Plating: Tin,Matte; Case/Package: TO-236-3; Width: 1.4mm; Termination: SMD/SMT; Package Quantity: 3000; Reach SVHC Compliant: Yes; Sensor Type: Temperature; Output Current: 100uA; Max Supply Voltage (DC): 4.4V; Series: -; Min Operating Temperature: -40°C; Pins: 3; Min Supply Voltage (DC): 2.7V; Max Supply Voltage: 4.4V; Packaging: Tape and Reel
U7 = CMP-006-000015-2: KX134 Series 3.6 V ±8g/16g/32g/64g SMT 3 Axis Digital Accelerometer- LGA-12; pin to pad: 8,9>8+9; GateName_1: G$1; Axis: X, Y, Z; Output Type: SPI,I2C; Bandwidth: 0.39Hz; SymbolName_1: KX134-1211; LibraryName: MCU Board; DeviceSetName: KX134-1211; Component Type: Standard; Source: MCU Board.SCHLIB; Package: KX134-1211; Pin Count: 10; Design Item ID: KX134-1211; Case/Package: VFLGA; Series: -; Max Operating Temperature: 105°C; Mounting Technology: Surface Mount; Min Operating Temperature: -40°C

## Sheet MCU_REVB_3.SchDoc: Big-MCU
size 270 x 223 mm; Origin: Eagle; Date: 2023-01-13 8:42:14 AM; SheetNumber: 4; GateName_1: G$1; SymbolName_1: LETTER_L; LibraryName: frames; DeviceSetName: LETTER_L; GateName_2: G$2; SymbolName_2: DOCFIELD; Sheet: Sheet:; REV: REV:
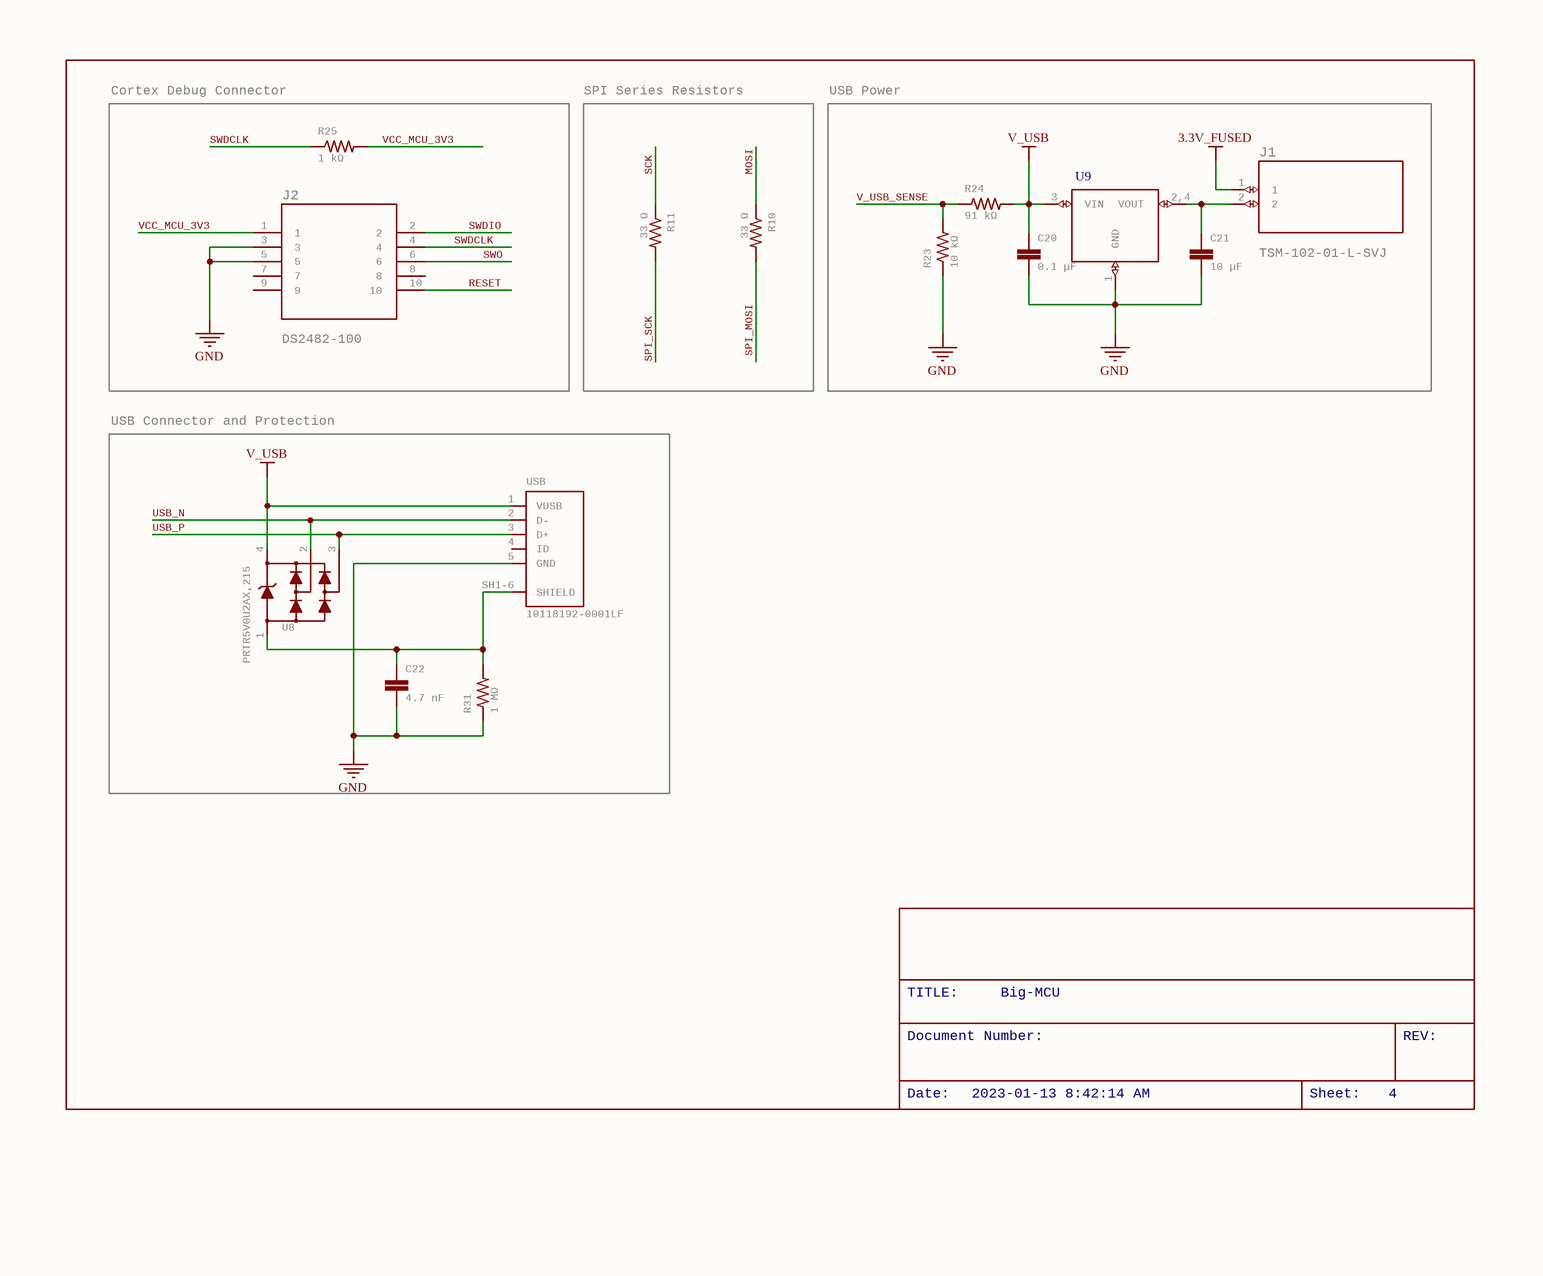
[diagram p3: MCU_REVB_3.SchDoc]

### Parts
C20  0.1 µF  [C0805]
C21  10 µF  [C1206]
C22  4.7 nF  [C0805]
J1  TSM-102-01-L-SVJ  [FP-TSM-102-01-L-SV-P-TR-MFG]
J2  DS2482-100  [SAMTEC-FTSH-105-01-X-DV]
R10  33 Ω  [6-0805_N]
R11  33 Ω  [6-0805_N]
R23  10 kΩ  [6-0805_N]
R24  91 kΩ  [6-0805_N]
R25  1 kΩ  [6-0805_N]
R31  1 MΩ  [6-0805_N]
U8  PRTR5V0U2AX,215  [FP-SOT143B-MFG]
U9  LDL1117S33R  [FP-SOT223-0046067-IPC_B]  (value not drawn)
USB  10118192-0001LF  [FCI-10118192-0001LF-5_V]

### Blocks framed on the sheet
Cortex Debug Connector: J2 R25
SPI Series Resistors: R10 R11
USB Power: C20 C21 J1 R23 R24 U9
USB Connector and Protection: C22 R31 U8 USB

### Nets
3.3V_FUSED: J1.1
GND: C20.2 C21.2 C22.2 J2.3 J2.5 R23.1 R31.1 U9.1(GND) USB.5(GND)
V_USB: C20.1 R24.2 U8.4(P$4) U9.3(VIN) USB.1(VUSB)
MOSI: R10.1
RESET: J2.10
SCK: R11.1
SPI_MOSI: R10.2
SPI_SCK: R11.2
SWDCLK: J2.4 R25.1
SWDIO: J2.2
SWO: J2.6
USB_N: U8.2(P$2) USB.2(D-)
USB_P: U8.3(P$3) USB.3(D+)
V_USB_SENSE: R23.2 R24.1
VCC_MCU_3V3: J2.1 R25.2
NetC21_1: C21.1 J1.2 U9.2,4(VOUT)
NetC22_1: C22.1 R31.2 U8.1(P$1) USB.SH1-6(SHIELD)

Not connected (* = marked no-connect by the designer): J2 7 8 9; USB 4(ID)

### Notes on the sheet
- TITLE:
- Big-MCU
- Document Number:
- REV:
- Date:
- 2023-01-13 8:42:14 AM
- Sheet:
- 4

### Library data of the parts
C20 C22 = C-EUC0805: as C5 on sheet MCU_REVB_1; DeviceName: C0805; LibraryName: rcl; DeviceSetName: C-EU; SPICEPREFIX: C
C21 = C-EUC1206: as C7 on sheet MCU_REVB_1; DeviceName: C1206; LibraryName: rcl; DeviceSetName: C-EU; SPICEPREFIX: C
J1 = CMP-006-000025-2: Conn Unshrouded Header HDR 2 POS 2.54mm Solder ST Top Entry SMD T/R; GateName_1: A; SymbolName_1: TSM-102-01-L-SVA; DeviceName: J; MF: Samtec; Number of Contacts: 2; Max Voltage Rating (AC): 475V; Gender: Male; Max Current Rating: 7A; LibraryName: MCU Board; DeviceSetName: TSM-102-01-L-SV; DIGI-KEY_PART_NUMBER: SAM14923TR-ND; MP: TSM-102-01-L-SV; Package: TSM-102-01-L-SV; TOBY_UK-PURCHASE-URL: https://snapeda.com/shop?store=Toby+UK&id=2748087; Pin Count: 2; Source: MCU Board.SCHLIB; Component Type: Standard; Design Item ID: TSM-102-01-L-SVJ; Packaging: Tape and Reel; Number of Rows: 1; Pitch: 2.54mm; Reach SVHC Compliant: Yes; Housing Color: Black; Max Operating Temperature: 125°C; Radiation Hardening: No; Lead Free: Lead Free; Housing Material: Polymer; Contact Plating: Gold; Termination: Solder; Contact Material: Bronze; Orientation: Straight; Length: 5.08mm; Depth: 2.54mm; Min Operating Temperature: -55°C; RoHS Compliant: Yes
J2 = CMP-006-000020-2: Conn Unshrouded Header HDR 10 POS 1.27mm Solder ST Top Entry SMD Tube; GateName_1: A; SymbolName_1: SAMTEC-FTSH-105-01-X-DVA; DeviceName: J; Current Rating: 1.75A; Connector Type: Male Pin; Number of Positions: 10; Gender: Male; Row Spacing: 0.05inch; LibraryName: MCU Board; DeviceSetName: SAMTEC-FTSH-105-01-X-DV; Design Item ID: SAMTEC-FTSH-105-01-X-DVJ; Component Type: Standard; Package Quantity: 1; Housing Material: Polymer; Max Operating Temperature: 125°C; Packaging: Bulk; Package: SAMTEC-FTSH-105-01-X-DV; Orientation: Straight; Housing Color: Black; Lead Free: Lead Free; Depth: 3.43mm; Min Operating Temperature: -55°C; Mounting Technology: Surface Mount; Length: 6.35mm; Pin Count: 10; Termination: Solder; Reach SVHC Compliant: Yes; Source: MCU Board.SCHLIB; Color: Black; Contact Plating: Gold; Contact Material: Bronze; Pitch: 1.27mm; Max Current Rating: 1.75A; Contact Type: Male Pin; Series: FTSH; Number of Rows: 2; Number of Contacts: 10; Contact Mating Length: 0.12inch; RoHS Compliant: Yes
R10 R11 R23-R25 R31 = R-US_R0805: as R12 on sheet MCU_REVB_1; LibraryName: rcl; SPICEPREFIX: R
U8 = CMP-003-000007-2: TVS DIODE 5.5VWM SOT143B; GateName_1: G$1; SymbolName_1: PRTR5V0U2X_215; LibraryName: MCU Board; DeviceSetName: PRTR5V0U2X_215; Pin Count: 4; Component Type: Standard; Source: MCU Board.SCHLIB; Design Item ID: PRTR5V0U2X_215; Package: SOT143B
U9 = CMP-006-000017-2: 1.2AHIGHPSRRLOWDROPOUTLINE; pin to pad: 2,4>2+4; GateName_1: G$1; Min Input Voltage: 2.5V; Min Output Voltage: 3.3V; Output Configuration: Positive; Dropout Voltage: 350mV; Number of Outputs: 1; Power Supply Rejection Ratio (PSRR): 65dB; Quiescent Current: 250uA; Output Current: 1.2A; Output Type: Fixed; Max Supply Voltage: 18V; SymbolName_1: LDL1117; LibraryName: MCU Board; DeviceSetName: LDL1117S33R; Design Item ID: LDL1117S33R; Package: SOT223; Pin Count: 3; Source: MCU Board.SCHLIB; Component Type: Standard; Case/Package: SOT-223-4; Weight: 0.009171oz; RoHS Compliant: Yes; Min Operating Temperature: -40°C; Mounting Technology: Surface Mount; Package Quantity: 2500; Packaging: Tape and Reel; Output Voltage: 3.3V; Max Operating Temperature: 125°C; Series: LDL1117; Number of Regulators: 1
USB = CMP-006-000000-3: CONN USB MICRO B RECPT SMT R/A; pin to pad: SH1-6>6+7+8+9+10+11; GateName_1: G$1; SymbolName_1: 10118192-0001LF; LibraryName: MCU Board; DeviceSetName: 10118192-0001LF; Source: MCU Board.SCHLIB; Component Type: Standard; Pin Count: 6; Design Item ID: 10118192-0001LF; Package: 10118192-0001LF

## Sheet MCU_REVB_4.SchDoc: Big-MCU
size 270 x 223 mm; Origin: Eagle; Date: 2023-01-13 8:42:14 AM; SheetNumber: 5; GateName_1: G$1; SymbolName_1: LETTER_L; LibraryName: frames; DeviceSetName: LETTER_L; GateName_2: G$2; SymbolName_2: DOCFIELD; Sheet: Sheet:; REV: REV:
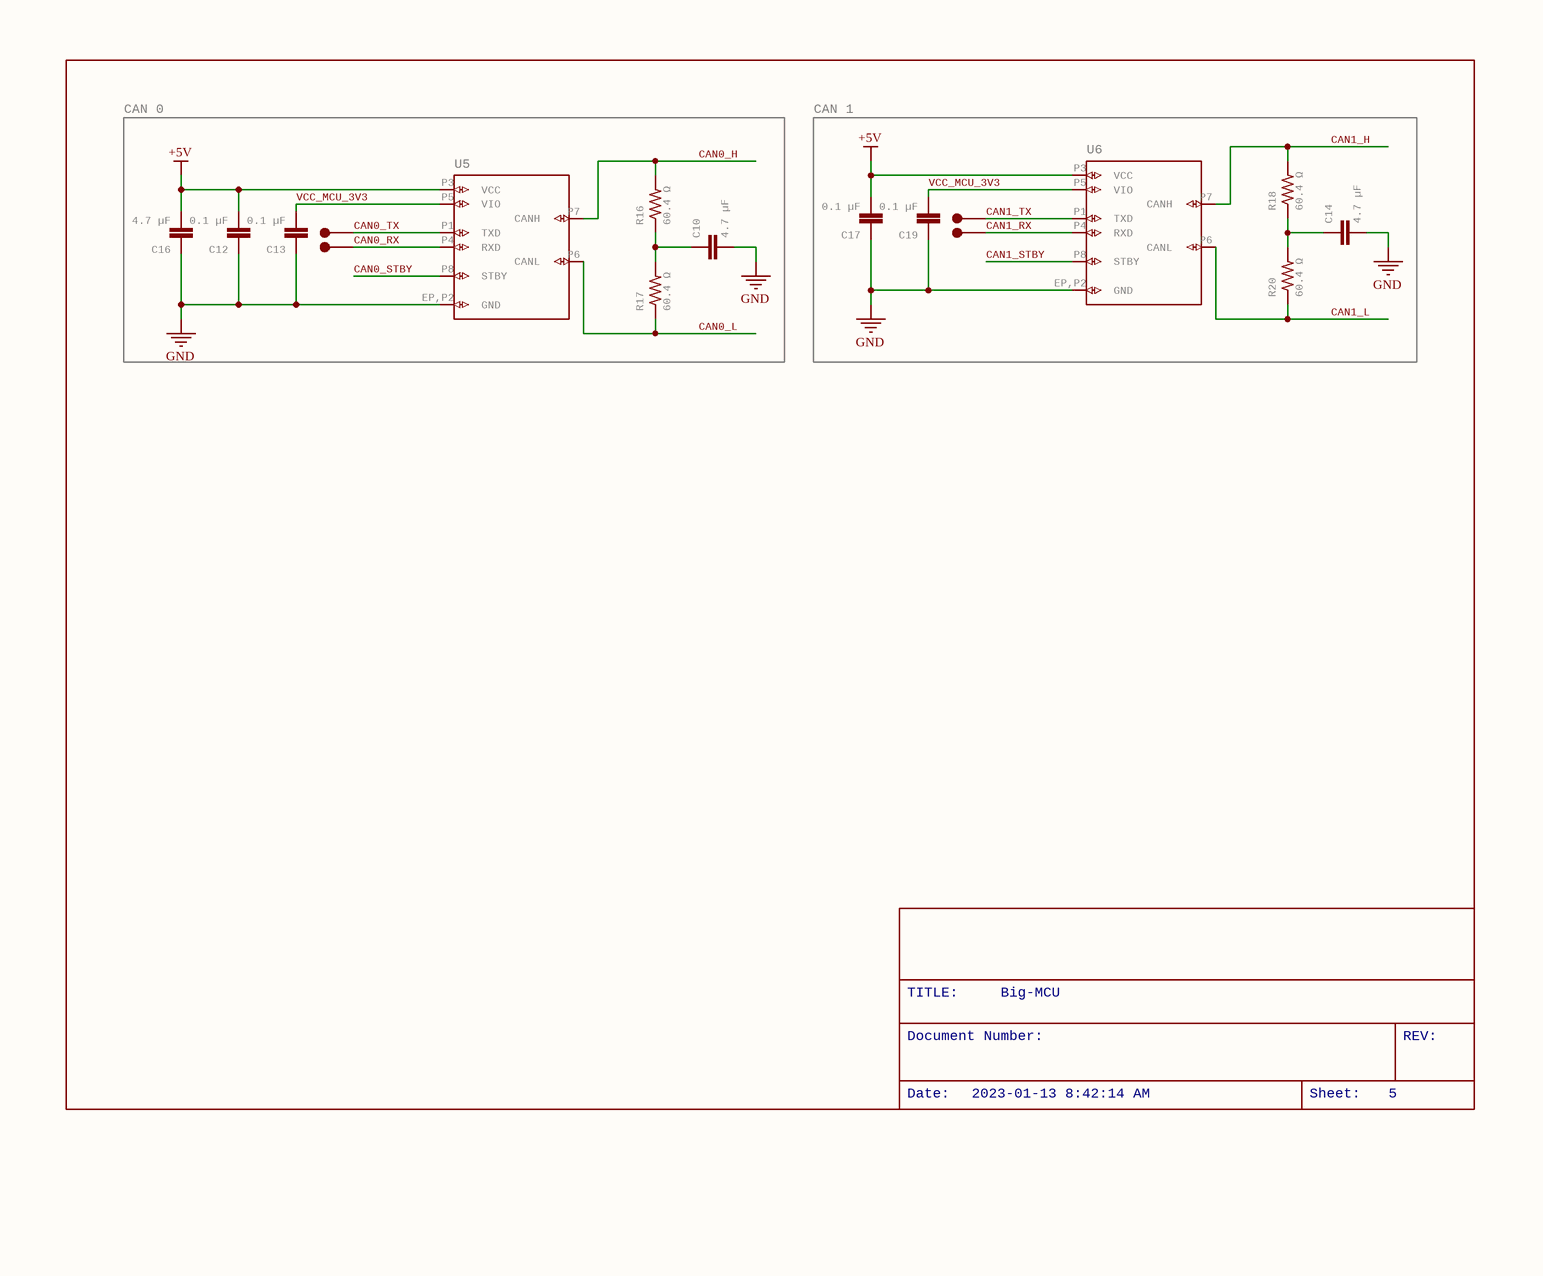
[diagram p4: MCU_REVB_4.SchDoc]

### Parts
C10  4.7 µF  [C0805]
C12  0.1 µF  [C0805]
C13  0.1 µF  [C0805]
C14  4.7 µF  [C0805]
C16  4.7 µF  [C0805]
C17  0.1 µF  [C0805]
C19  0.1 µF  [C0805]
R16  60.4 Ω  [C1206]
R17  60.4 Ω  [C1206]
R18  60.4 Ω  [C1206]
R20  60.4 Ω  [C1206]
TP17  5015  [KEYSTONE_5015]  (value not drawn)
TP18  5015  [KEYSTONE_5015]  (value not drawn)
TP19  5015  [KEYSTONE_5015]  (value not drawn)
TP20  5015  [KEYSTONE_5015]  (value not drawn)
U5  ATA6561  [FP-C04-057-OA-MFG]  (value not drawn)
U6  ATA6561  [FP-C04-057-OA-MFG]  (value not drawn)

### Blocks framed on the sheet
CAN 0: C10 C12 C13 C16 R16 R17 TP17 TP18 U5
CAN 1: C14 C17 C19 R18 R20 TP19 TP20 U6

### Nets
+5V: C12.2 C16.2 C17.2 U5.P3(VCC) U6.P3(VCC)
GND: C10.2 C12.1 C13.1 C14.2 C16.1 C17.1 C19.1 U5.EP,P2(GND) U6.EP,P2(GND)
CAN0_H: R16.2 U5.P7(CANH)
CAN0_L: R17.1 U5.P6(CANL)
CAN0_RX: TP17.1(TP) U5.P4(RXD)
CAN0_STBY: U5.P8(STBY)
CAN0_TX: TP18.1(TP) U5.P1(TXD)
CAN1_H: R18.2 U6.P7(CANH)
CAN1_L: R20.1 U6.P6(CANL)
CAN1_RX: TP20.1(TP) U6.P4(RXD)
CAN1_STBY: U6.P8(STBY)
CAN1_TX: TP19.1(TP) U6.P1(TXD)
VCC_MCU_3V3: C13.2 C19.2 U5.P5(VIO) U6.P5(VIO)
NetC10_1: C10.1 R16.1 R17.2
NetC14_1: C14.1 R18.1 R20.2

### Notes on the sheet
- TITLE:
- Big-MCU
- Document Number:
- REV:
- Date:
- 2023-01-13 8:42:14 AM
- Sheet:
- 5

### Library data of the parts
C10 C12-C14 C16 C17 C19 = C-EUC0805: as C5 on sheet MCU_REVB_1; DeviceName: C0805; LibraryName: rcl; DeviceSetName: C-EU; SPICEPREFIX: C
R16-R18 R20 = R-US_R1206: RESISTOR, American symbol; GateName_1: G$1; SymbolName_1: R-US; DeviceName: R1206; DeviceSetName: R-US_; POPULARITY: 19; LibraryName: rcl; SPICEPREFIX: R
TP17-TP20 = CMP-005-000003-3: as TP11 on sheet MCU_REVB_1; SymbolName_1: 5015; LibraryName: MCU Board; DeviceSetName: 5015; AVAILABILITY: Unavailable; MOUSER-PURCHASE-URL: https://snapeda.com/shop?store=Mouser&id=48459; MP: 5015; Package: KEYSTONE_5015; PRICE: None; Component Type: Standard; Design Item ID: 5015; Pin Count: 1; Source: MCU Board.SCHLIB
U5 U6 = CMP-006-000003-2: ATA6561 Series 5 Mbit/s 3 to 5 V ±8 kV Standby Mode CAN Transceiver - SOIC-8; pin to pad: EP,P2>2 P1>1 P3>3 P4>4 P5>5 P6>6 P7>7 P8>8; GateName_1: G$1; Receiver Hysteresis: 120mV; Number of Transceivers: 1; Data Rate: 5Mbps; Max Supply Voltage: 5.5V; Min Supply Voltage: 4.5V; Max Supply Current: 5mA; SymbolName_1: ATA6561; LibraryName: MCU Board; DeviceSetName: ATA6561; Component Type: Standard; Pin Count: 8; Package: VDFN8; Design Item ID: ATA6561; Source: MCU Board.SCHLIB; Series: Automotive, AEC-Q100; Min Operating Temperature: -40°C; Mounting Technology: Surface Mount; Lead Free: Lead Free; Packaging: Cut Tape; Pins: 8; Max Operating Temperature: 150°C; RoHS Compliant: Yes; Case/Package: SOIC

## Nets that join several sheets
3.3V_FUSED: MCU_REVB_0 (F1.2), MCU_REVB_1 (L1.1), MCU_REVB_3 (J1.1)
GND: MCU_REVB_1 (25 pins), MCU_REVB_2 (20 pins), MCU_REVB_3 (9 pins), MCU_REVB_4 (9 pins)
ACCEL_CS: MCU_REVB_1 (TP15.1 U4.81), MCU_REVB_2 (U7.10)
ACCEL_INT_1: MCU_REVB_1 (TP11.1 U4.73), MCU_REVB_2 (U7.5)
ACCEL_INT_2: MCU_REVB_1 (TP13.1 U4.72), MCU_REVB_2 (U7.6)
ACCEL_TRIG: MCU_REVB_1 (U4.80), MCU_REVB_2 (U7.4)
CAN0_RX: MCU_REVB_1 (U4.93), MCU_REVB_4 (TP17.1 U5.P4)
CAN0_STBY: MCU_REVB_1 (U4.105), MCU_REVB_4 (U5.P8)
CAN0_TX: MCU_REVB_1 (U4.92), MCU_REVB_4 (TP18.1 U5.P1)
CAN1_RX: MCU_REVB_1 (U4.44), MCU_REVB_4 (TP20.1 U6.P4)
CAN1_STBY: MCU_REVB_1 (U4.104), MCU_REVB_4 (U6.P8)
CAN1_TX: MCU_REVB_1 (U4.43), MCU_REVB_4 (TP19.1 U6.P1)
DEBUG_0: MCU_REVB_1 (U4.68), MCU_REVB_2 (R32.2)
DEBUG_1: MCU_REVB_1 (U4.69), MCU_REVB_2 (R33.2)
I2C0_SCL: MCU_REVB_1 (R13.1 U4.48), MCU_REVB_2 (U1.4)
I2C0_SDA: MCU_REVB_1 (R12.1 U4.47), MCU_REVB_2 (U1.5)
MOSI: MCU_REVB_1 (U4.27), MCU_REVB_3 (R10.1)
RESET: MCU_REVB_1 (R15.2), MCU_REVB_3 (J2.10)
SCK: MCU_REVB_1 (U4.28), MCU_REVB_3 (R11.1)
SD_ACTIVE_LED: MCU_REVB_1 (U4.122), MCU_REVB_2 (R1.2)
SDCD: MCU_REVB_1 (U4.41), MCU_REVB_2 (MICRO_SD.10 R9.1 TP8.1)
SDCK: MCU_REVB_1 (U4.40), MCU_REVB_2 (MICRO_SD.5 TP7.1)
SDCMD: MCU_REVB_1 (U4.33), MCU_REVB_2 (MICRO_SD.3 R5.1 TP4.1)
SDDAT0: MCU_REVB_1 (U4.34), MCU_REVB_2 (MICRO_SD.7 R4.1 TP3.1)
SDDAT1: MCU_REVB_1 (U4.35), MCU_REVB_2 (MICRO_SD.8 R2.1 TP1.1)
SDDAT2: MCU_REVB_1 (U4.36), MCU_REVB_2 (MICRO_SD.1 R8.1 TP6.1)
SDDAT3: MCU_REVB_1 (U4.39), MCU_REVB_2 (MICRO_SD.2 R6.1 TP5.1)
SPI1_MISO: MCU_REVB_1 (TP16.1 U4.84), MCU_REVB_2 (R22.2)
SPI1_MOSI: MCU_REVB_1 (TP12.1 U4.82), MCU_REVB_2 (R19.2)
SPI1_SCK: MCU_REVB_1 (TP14.1 U4.83), MCU_REVB_2 (R21.2)
STAT_B: MCU_REVB_1 (U4.85), MCU_REVB_2 (R26.2)
STAT_G: MCU_REVB_1 (U4.86), MCU_REVB_2 (R27.2)
STAT_R: MCU_REVB_1 (U4.87), MCU_REVB_2 (R28.2)
SWDCLK: MCU_REVB_1 (U4.119), MCU_REVB_3 (J2.4 R25.1)
SWDIO: MCU_REVB_1 (U4.120), MCU_REVB_3 (J2.2)
SWO: MCU_REVB_1 (U4.121), MCU_REVB_3 (J2.6)
TEMP_SENSE: MCU_REVB_1 (U4.13), MCU_REVB_2 (U3.2)
TEMP_SENSE_VDD: MCU_REVB_1 (U4.30), MCU_REVB_2 (U3.1)
USB_N: MCU_REVB_1 (U4.94), MCU_REVB_3 (U8.2 USB.2)
USB_P: MCU_REVB_1 (U4.95), MCU_REVB_3 (U8.3 USB.3)
V_USB_SENSE: MCU_REVB_1 (U4.3), MCU_REVB_3 (R23.2 R24.1)
VBAT: MCU_REVB_1 (U4.128), MCU_REVB_2 (5 pins)
VCC_MCU_3V3: MCU_REVB_1 (21 pins), MCU_REVB_2 (17 pins), MCU_REVB_3 (J2.1 R25.2), MCU_REVB_4 (C13.2 C19.2 U5.P5 U6.P5)